# EasyEDA Pro project banzang电容_2023-06-19.epro, schematic POWER

## Sheets
1 POWER: Create Date: 2024-03-19; Page Name: POWER; Project Name: 河鸽の电容; Schematic Name: POWER; Update Date: 2024-03-19; Company: 嘉立创EDA; Page Size: B; Version: V1.0
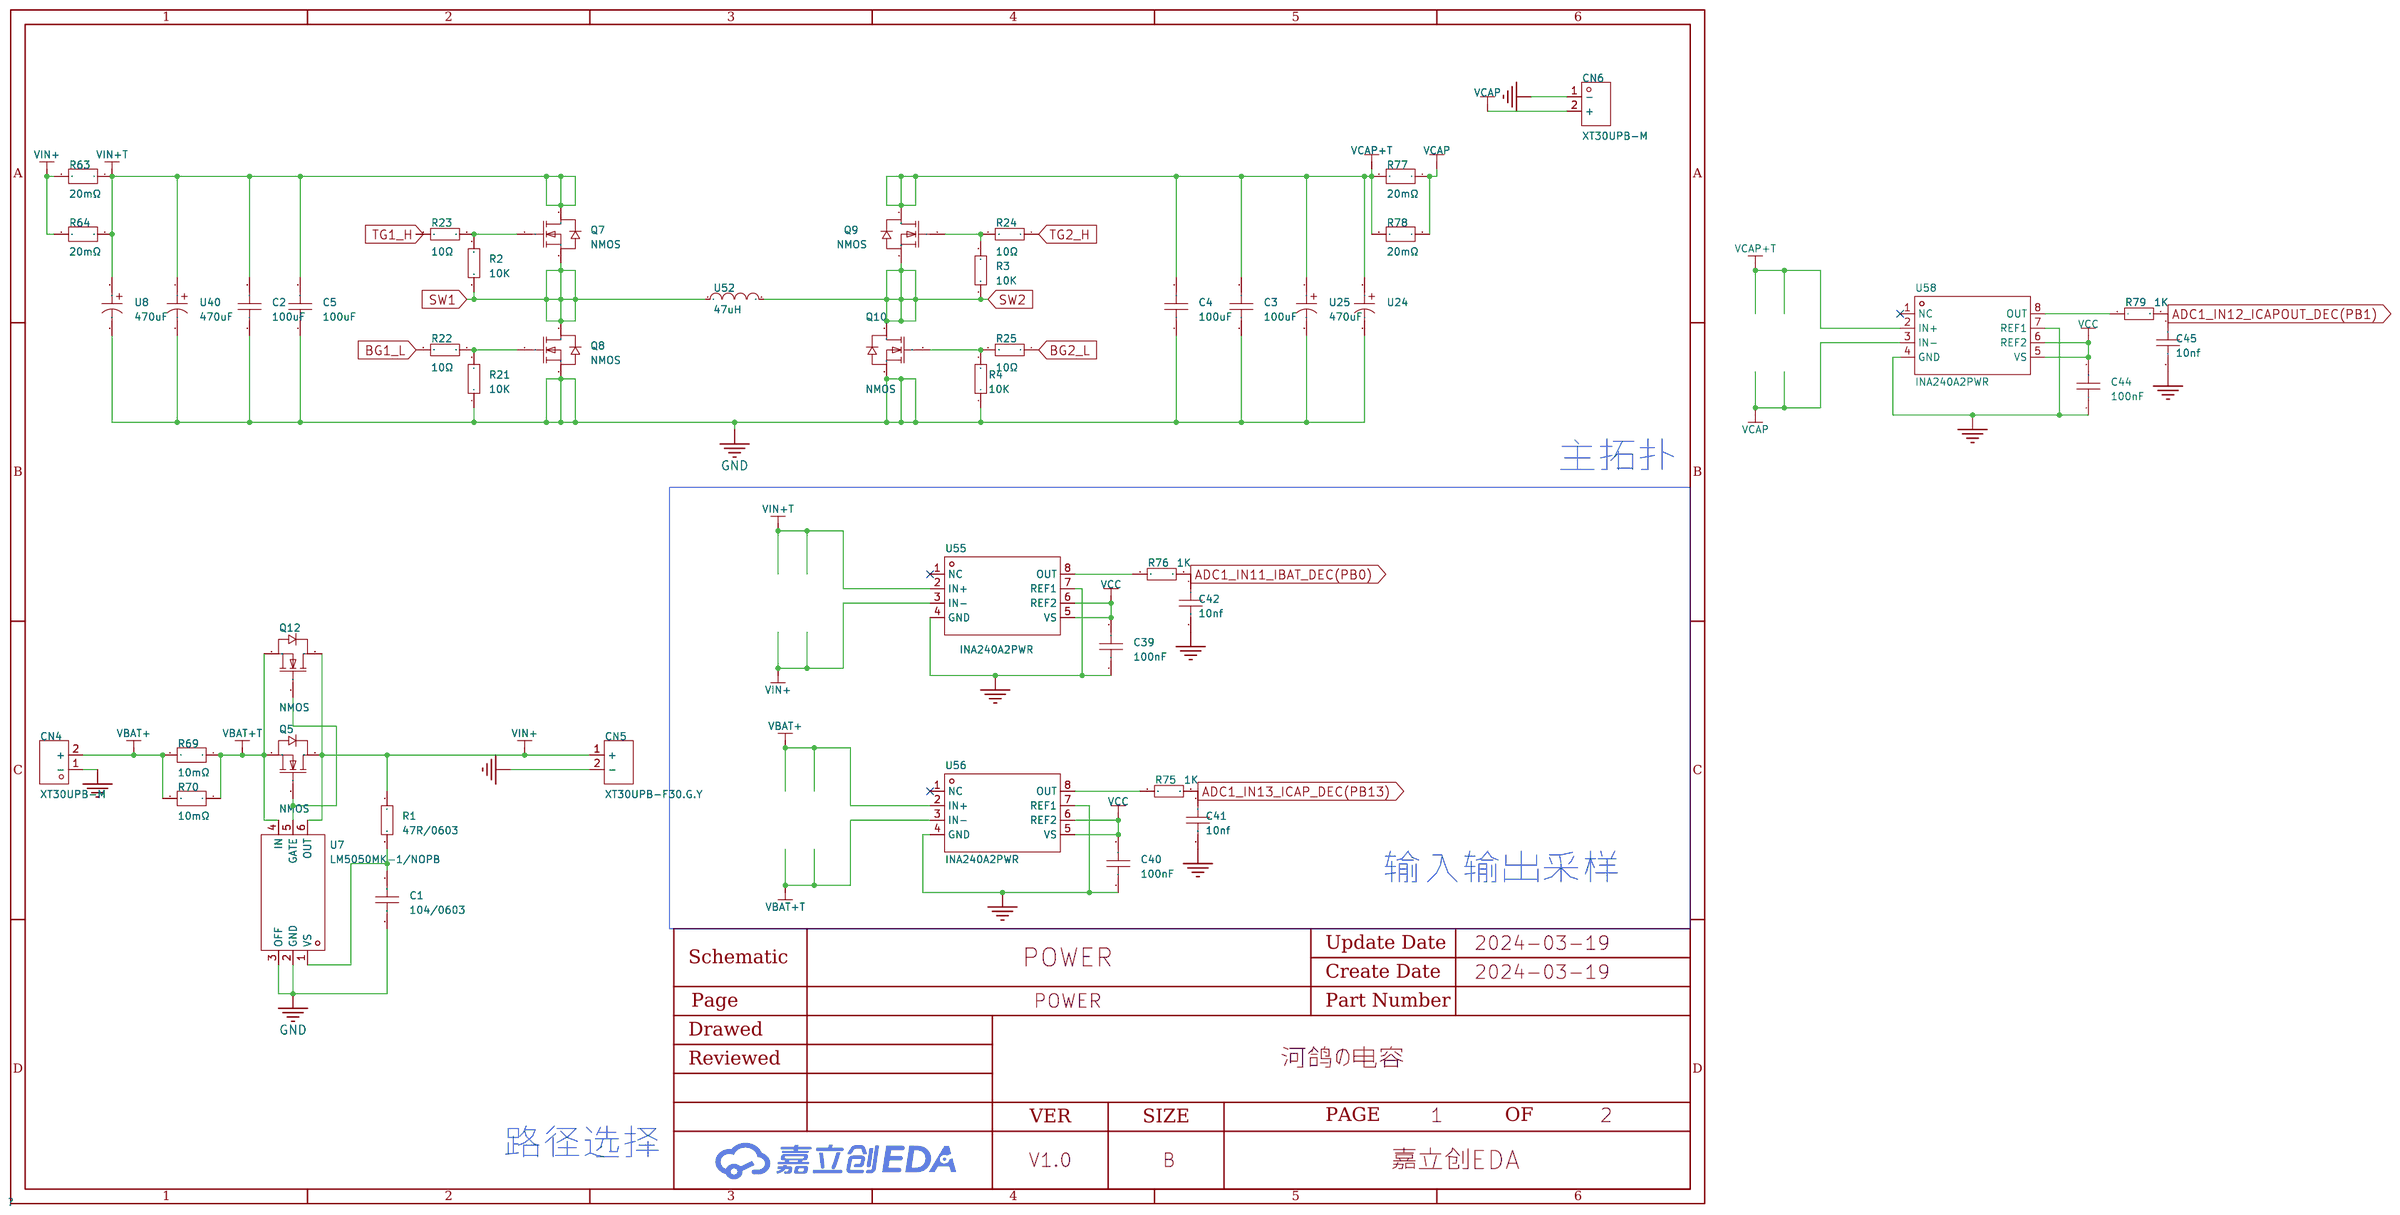
[diagram p0: POWER]
2 CONTROL: Create Date: 2023-07-25; Page Name: CONTROL; Update Date: 2023-10-28; Page Size: C
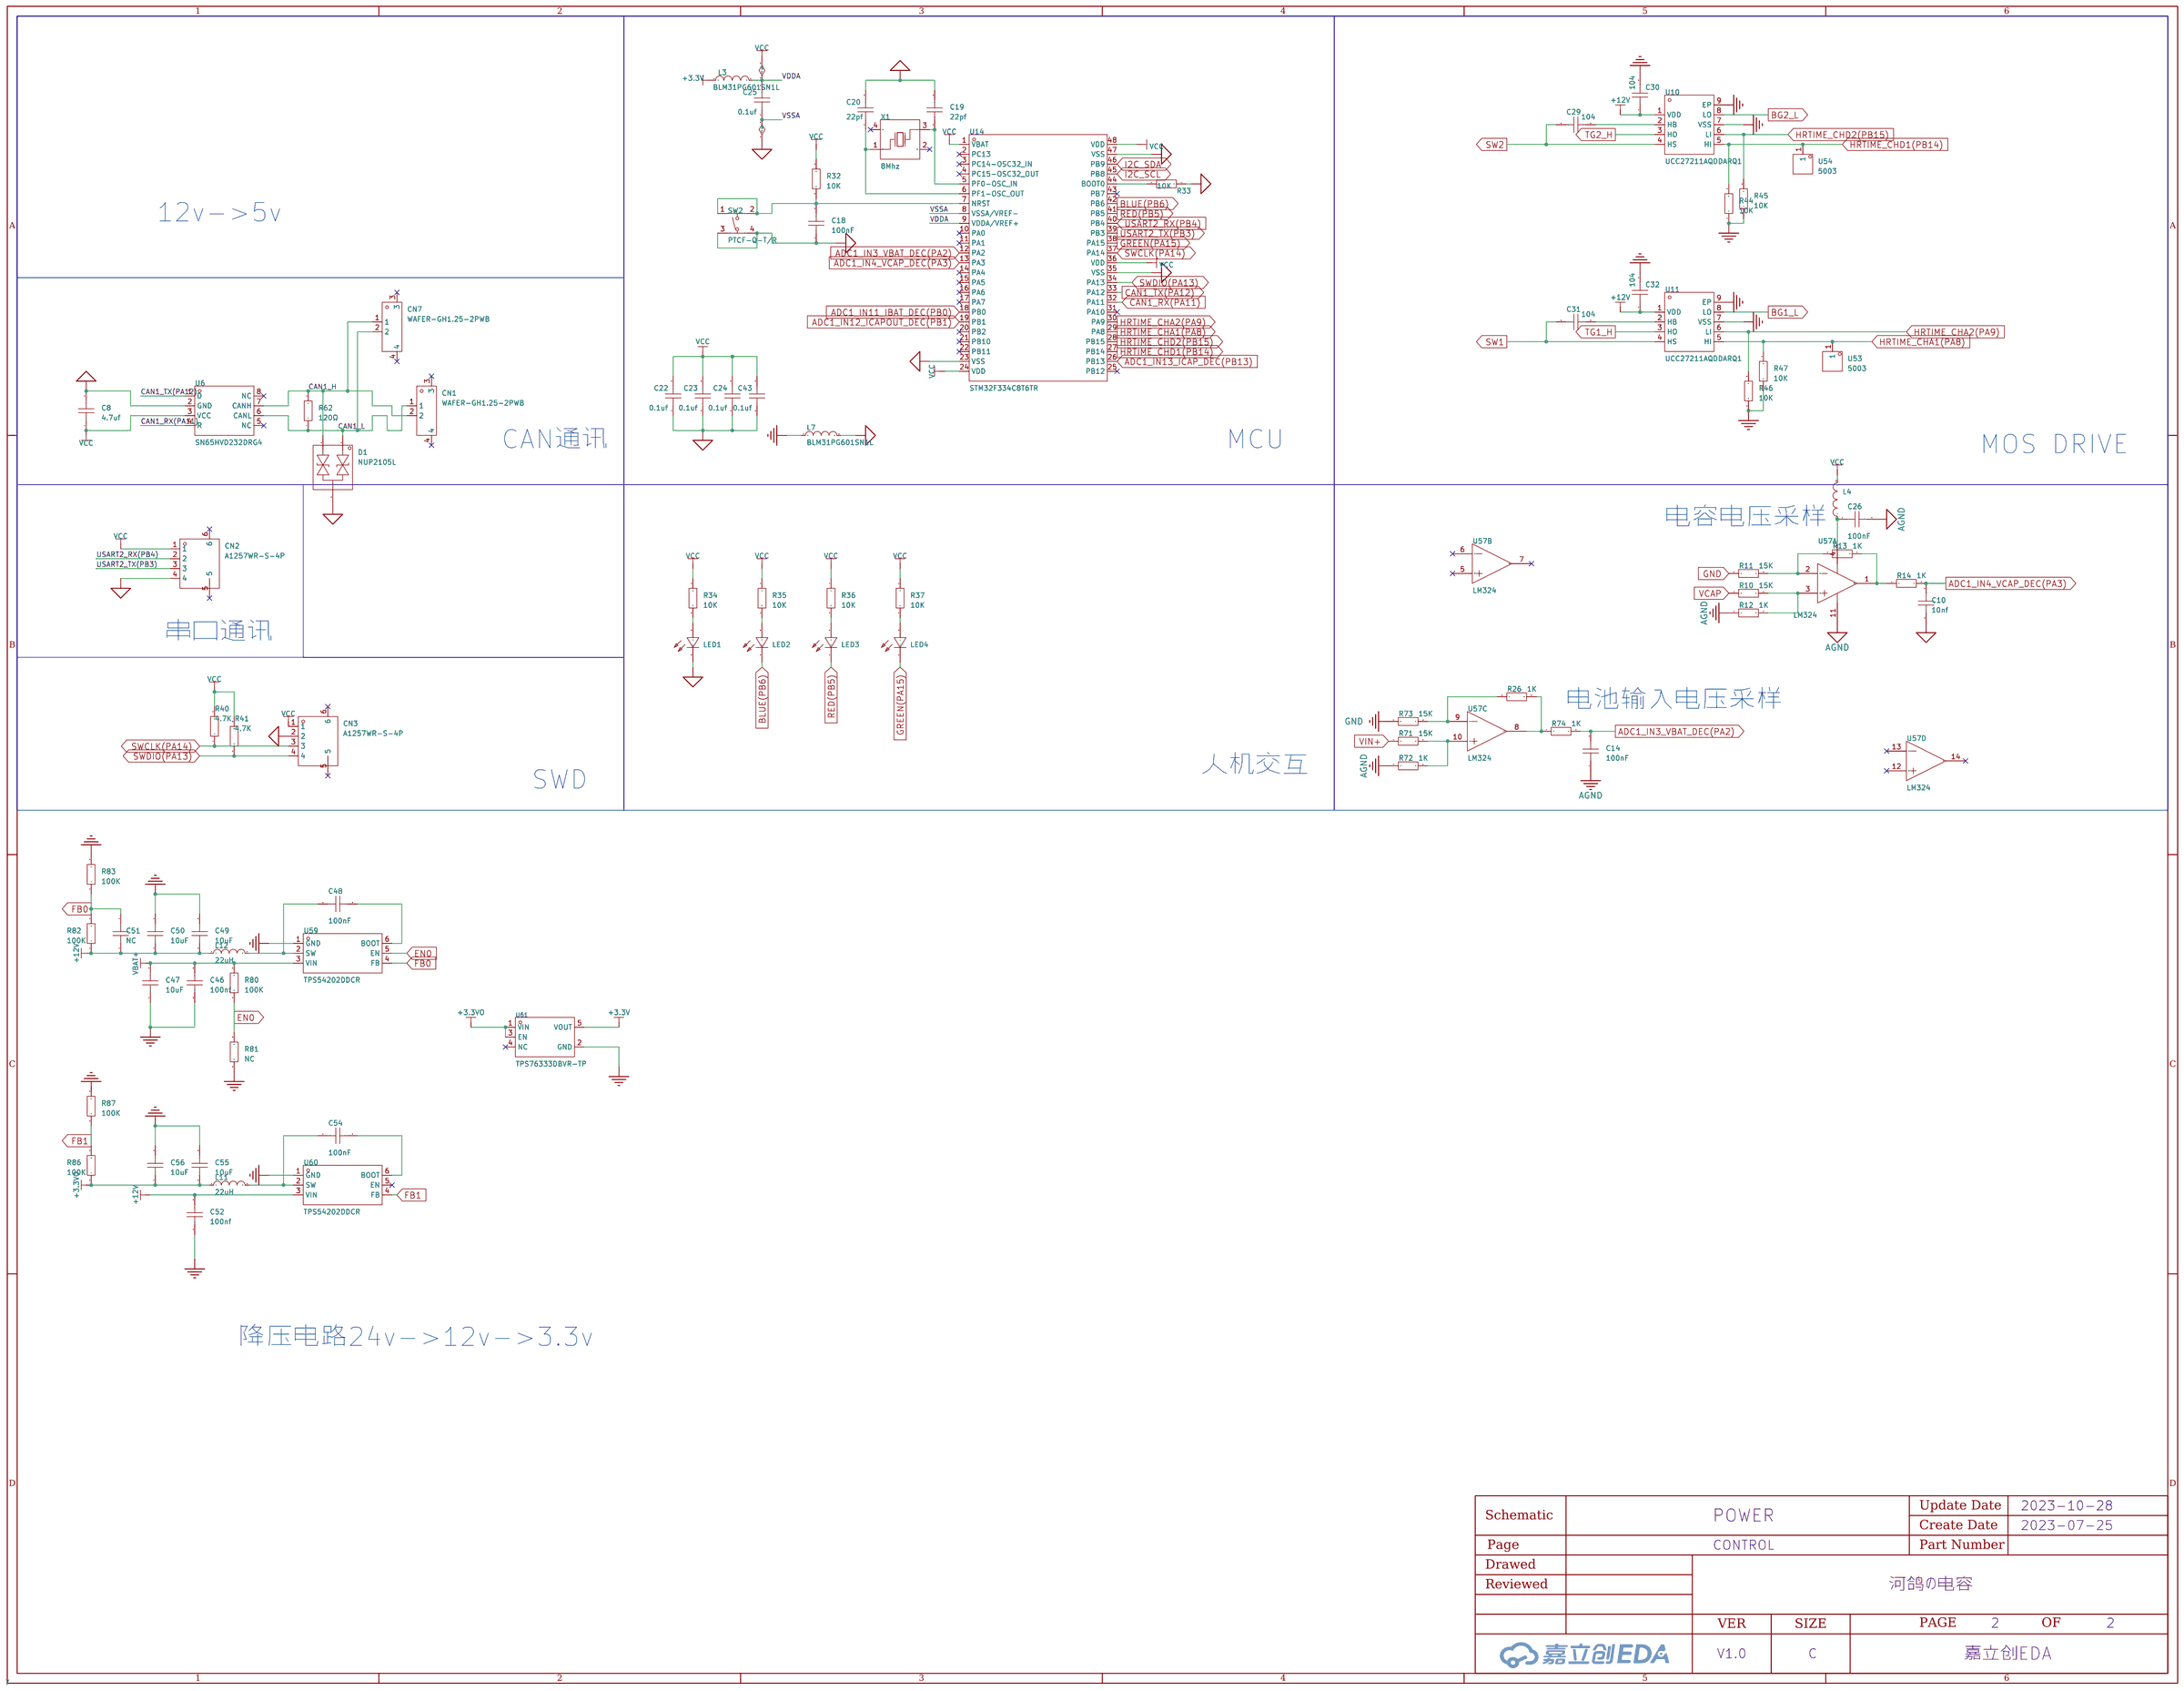
[diagram p1: CONTROL]

## Parts
sheet CONTROL
C8  4.7uf  [C0603]
C10  10nf  [C0603]
C14  100nF  [C0603]
C18  100nF  [C0603]
C19  22pf  [C0603]
C20  22pf  [C0603]
C22  0.1uf  [C0603]
C23  0.1uf  [C0603]
C24  0.1uf  [C0603]
C25  0.1uf  [C0603]
C26  100nF  [C0603]
C29  104  [C0603]
C30  104  [C0603]
C31  104  [C0603]
C32  104  [C0603]
C43  0.1uf  [C0603]
C46  100nf  [C0603]
C47  10uF  [C1206]
C48  100nF  [C0603]
C49  10uF  [C1206]
C50  10uF  [C1206]
C51  NC  [C0603]
C52  100nf  [C0603]
C54  100nF  [C0603]
C55  10uF  [C1206]
C56  10uF  [C1206]
CN1  WAFER-GH1.25-2PWB  [CONN-TH_2P-P1.25_XUNPU_WAFER-GH1.25-2PWB]
CN2  A1257WR-S-4P  [CONN-SMD_A1257WR-S-4P]
CN3  A1257WR-S-4P  [CONN-SMD_A1257WR-S-4P]
CN7  WAFER-GH1.25-2PWB  [CONN-TH_2P-P1.25_XUNPU_WAFER-GH1.25-2PWB]
D1  NUP2105L  [SOT-23-3_L2.9-W1.3-P1.90-LS2.4-BR]
L3  BLM31PG601SN1L  [L1206]
L4  10uH  [L1206]
L7  BLM31PG601SN1L  [L1206]
L11  22uH  [IND-SMD_L4.5-W4.0_CD43]
L12  22uH  [IND-SMD_L4.5-W4.0_CD43]
LED1  19-217/GHC-YR1S2/3T  [LED0603-RD]
LED2  19-217/GHC-YR1S2/3T  [LED0603-RD]
LED3  19-217/GHC-YR1S2/3T  [LED0603-RD]
LED4  19-217/GHC-YR1S2/3T  [LED0603-RD]
R10  15K  [R0603]
R11  15K  [R0603]
R12  1K  [R0603]
R13  1K  [R0603]
R14  1K  [R0603]
R26  1K  [R0603]
R32  10K  [R0603]
R33  10K  [R0603]
R34  10K  [R0603]
R35  10K  [R0603]
R36  10K  [R0603]
R37  10K  [R0603]
R40  4.7K  [R0603]
R41  4.7K  [R0603]
R44  10K  [R0603]
R45  10K  [R0603]
R46  10K  [R0603]
R47  10K  [R0603]
R62  120Ω  [R0603]
R71  15K  [R0603]
R72  1K  [R0603]
R73  15K  [R0603]
R74  1K  [R0603]
R80  100K  [R0603]
R81  NC  [R0603]
R82  100K  [R0603]
R83  100K  [R0603]
R86  100K  [R0603]
R87  100K  [R0603]
SW2  PTCF-Q-T/R  [SW-SMD_4P-L4.7-W3.5-P1.70-LS5.9]
U6  SN65HVD232DRG4  [SOIC-8_L4.9-W3.9-P1.27-LS6.0-BL]
U10  UCC27211AQDDARQ1  [SOPOWERPAD-8_L4.9-W3.9-P1.27-LS6.0-BL-EP]
U11  UCC27211AQDDARQ1  [SOPOWERPAD-8_L4.9-W3.9-P1.27-LS6.0-BL-EP]
U14  STM32F334C8T6TR  [LQFP-48_L7.0-W7.0-P0.50-LS9.0-BL]
U53  5003  [TEST-TH_BD2.54-P1.39]
U54  5003  [TEST-TH_BD2.54-P1.39]
U57  LM324  [SOP-14_L8.6-W3.9-P1.27-LS6.0-BL]  (sections 1,2,3,4)
U59  TPS54202DDCR  [SOT-23-6_L2.9-W1.6-P0.95-LS2.8-BL]
U60  TPS54202DDCR  [SOT-23-6_L2.9-W1.6-P0.95-LS2.8-BL]
U61  TPS76333DBVR-TP  [SOT-23-5_L3.0-W1.6-P0.95-LS2.8-BR]
X1  8Mhz  [OSC-SMD_4P-L3.2-W2.5-BL]
sheet POWER
C1  104/0603  [C0603]
C2  100uF  [C1210]
C3  100uF  [C1210]
C4  100uF  [C1210]
C5  100uF  [C1210]
C39  100nF  [C0603]
C40  100nF  [C0603]
C41  10nf  [C0603]
C42  10nf  [C0603]
C44  100nF  [C0603]
C45  10nf  [C0603]
CN4  XT30UPB-M  [CONN-TH_XT30UPB-M]
CN5  XT30UPB-F30.G.Y  [CONN-TH_XT30UPB-F]
CN6  XT30UPB-M  [CONN-TH_XT30UPB-M]
Q5  NMOS  [nmos qfn封装]
Q7  NMOS  [nmos qfn封装]
Q8  NMOS  [nmos qfn封装]
Q9  NMOS  [nmos qfn封装]
Q10  NMOS  [nmos qfn封装]
Q12  NMOS  [nmos qfn封装]
R1  47R/0603  [R0603]
R2  10K  [R0603]
R3  10K  [R0603]
R4  10K  [R0603]
R21  10K  [R0603]
R22  10Ω  [R0603]
R23  10Ω  [R0603]
R24  10Ω  [R0603]
R25  10Ω  [R0603]
R63  20mΩ  [RES-SMD_L6.4-W3.2-R2512]
R64  20mΩ  [RES-SMD_L6.4-W3.2-R2512]
R69  10mΩ  [RES-SMD_L6.4-W3.2-R2512]
R70  10mΩ  [RES-SMD_L6.4-W3.2-R2512]
R75  1K  [R0603]
R76  1K  [R0603]
R77  20mΩ  [RES-SMD_L6.4-W3.2-R2512]
R78  20mΩ  [RES-SMD_L6.4-W3.2-R2512]
R79  1K  [R0603]
U7  LM5050MK-1/NOPB  [TSOT-23-6_L2.9-W1.6-P0.95-LS2.8-BR]
U8  470uF  [CAP-TH_BD10.0-P5.00-D1.0-FD]
U24  470uF  [CAP-TH_BD10.0-P5.00-D1.0-FD]
U25  470uF  [CAP-TH_BD10.0-P5.00-D1.0-FD]
U40  470uF  [CAP-TH_BD10.0-P5.00-D1.0-FD]
U52  47uH  [IND-SMD_L17.2-W17.2]
U55  INA240A2PWR  [TSSOP-8_L4.4-W3.0-P0.65-LS6.4-BL]
U56  INA240A2PWR  [TSSOP-8_L4.4-W3.0-P0.65-LS6.4-BL]
U58  INA240A2PWR  [TSSOP-8_L4.4-W3.0-P0.65-LS6.4-BL]

## Library data of the parts
C1 C8 C10 C14 C18-C20 C22-C26 C29-C32 C39-C46 C48 C51 C52 C54 = CAP_0603: Supplier Footprint: 0603
C47 C49 C50 C55 C56 = CL31A106KBHNNNE: 容值:10uF;精度:±10%;额定电压:50V;材质(温度系数):X5R;; LCSC Part Name: 10uF ±10% 50V; Supplier Part: C13585; Manufacturer: SAMSUNG(三星); Supplier Footprint: 1206; JLCPCB Part Class: Basic Part; Datasheet: https://atta.szlcsc.com/upload/public/pdf/source/20160103/1457707668742.pdf; Supplier: LCSC; Tolerance: ±10%; Voltage Rated: 50V; Temperature Coefficient: X5R
CN1 CN7 = WAFER-GH1.25-2PWB: 参考系列:GH;间距:1.25mm;插针结构:1x2P;排数:1;每排PIN数:2;公母:公型插针;安装方式:卧贴;额定电流:1A;工作温度范围:-25℃~+85℃;; LCSC Part Name: GH1.25mm 2P 卧贴带扣 带扣; Supplier Part: C3029377; Manufacturer: XUNPU(讯普); Supplier Footprint: SMD,P=1.25mm; JLCPCB Part Class: Extended Part; Datasheet: https://atta.szlcsc.com/upload/public/pdf/source/20220527/CB8773BFB0913C3B8ABD62CB38BA101A.pdf; Supplier: LCSC; Reference Series: GH; Pitch: 1.25mm; Pins Structure: 1x2P; Number of Rows: 1; Number of PINs Per Row: 2; Gender: 公型插针; Mounting Style: 卧贴; Current Rating (Max): 1A; Operating Temperature Range: -25℃~+85℃
CN2 CN3 = A1257WR-S-4P: 参考系列:GH;间距:1.25mm;插针结构:1x4P;排数:1;每排PIN数:4;行距:-;安装方式:-;触头材质:黄铜;; LCSC Part Name: GH1.25卧式贴片 镀锡 4P 针座连接器; Supplier Part: C225127; Manufacturer: CJT(长江连接器); Supplier Footprint: SMD,P=1.25mm; JLCPCB Part Class: Extended Part; Datasheet: https://atta.szlcsc.com/upload/public/pdf/source/20180509/C225127_D8D3C7F8F1F45F960D198B1E232900BE.pdf; Supplier: LCSC; Reference Series: GH; Pitch: 1.25mm; Pins Structure: 1x4P; Number of Rows: 1; Number of PINs Per Row: 4; Contact Material: 黄铜
D1 = NUP2105L: 双向 反向截止电压(Vrwm)：24V@Max 击穿电压(最小值)：26.7V 峰值脉冲电流(Ipp)@10/1000μs：8A@8/20us 最大钳位电压：54V; Supplier Part: C284104; Manufacturer: DOWO(东沃); Supplier Footprint: SOT-23; JLCPCB Part Class: Extended Part; Datasheet: https://atta.szlcsc.com/upload/public/pdf/source/20180913/C284104_A285154D8E570FC0FA2D74308019D511.pdf; Supplier: LCSC
L3 L7 = BLM31PG601SN1L: 标称阻抗@测试频率:600Ω@100MHz;误差:±25%;直流电阻(RDC):80mΩ;额定电流:1.5A;电路数:1;; LCSC Part Name: 600Ω@100MHz ±25%; Supplier Part: C16902; Manufacturer: muRata(村田); Supplier Footprint: 1206; JLCPCB Part Class: Extended Part; Datasheet: https://atta.szlcsc.com/upload/public/pdf/source/20170523/1495534024788.pdf; Supplier: LCSC; Impedance @ Frequency: 600Ω@100MHz; Tolerance: ±25%; DC Resistance: 80mΩ; Current Rating: 1.5A; Circuits: 1
L4 = 1206磁珠500R20%2A: Supplier Part: C9900009879; JLCPCB Part Class: Extended Part; Datasheet: https://atta.szlcsc.comnull; Supplier: LCSC
L11 L12 = CD43-220M: 额定电流:760mA;电感值:22uH;精度:±20%;直流电阻(DCR):378mΩ;; LCSC Part Name: 22uH ±20%; Supplier Part: C2826645; Manufacturer: DMBJ(振宝佳); Supplier Footprint: SMD; JLCPCB Part Class: Extended Part; Datasheet: https://atta.szlcsc.com/upload/public/pdf/source/20210416/C2826610_BD9EF4281FEC8102FBF66339CC69A197.pdf; Supplier: LCSC; Rated Current: 760mA; Tolerance: ±20%; Length: 4.5mm; DC Resistance (DCR): 378mΩ; Width: 4mm; Height: 3.2mm
LED1-LED4 = 19-217/GHC-YR1S2/3T: 发光颜色:翠绿;二极管配置:-;透镜颜色:无色透明;主波长:520nm~535nm;峰值波长:518nm;色温:-;测试电流:20mA;功率:110mW;发光角度:120°;安装方式:-;工作温度:-40℃~+85℃;; LCSC Part Name: 翠绿 520nm~535nm; Supplier Part: C72043; Manufacturer: EVERLIGHT(亿光); Supplier Footprint: 0603; JLCPCB Part Class: Basic Part; Datasheet: https://atta.szlcsc.com/upload/public/pdf/source/20160507/1462613613780.pdf; Supplier: LCSC; Emitted Color: 翠绿; Lens Color: 无色透明; Dominant Wavelength: 520nm~535nm; Peak Wavelength: 518nm; Forward Current: 20mA; Power Dissipation: 110mW; Viewing Angle: 120°; Operating Temperature: -40℃~+85℃
R1-R4 R10-R14 R21-R26 R32-R37 R40 R41 R44-R47 R62 R71-R76 R79-R83 R86 R87 = Res_0603: Supplier Footprint: 0603
SW2 = PTCF-Q-T/R: 触点电流:50mA;额定电压(DC):12V;电路结构:单刀单掷;按钮作用方向:侧面触动;致动器样式:矩形按钮;照明颜色:-;; LCSC Part Name: 侧按贴片; Supplier Part: C495928; Manufacturer: 圜达; Supplier Footprint: SMD,3.5x4.7mm; JLCPCB Part Class: Extended Part; Datasheet: https://atta.szlcsc.com/upload/public/pdf/source/20180719/C240298_0F3C3519E61C16272A76D63807525503.pdf; Supplier: LCSC; Contact Current: 50mA; Voltage Rating (DC): 12V; Circuit: 单刀单掷; Actuator Orientation: 侧面触动; Actuator Style: 矩形按钮
U6 = SN65HVD232DRG4: Supplier Part: C2671240; Manufacturer: TI(德州仪器); Supplier Footprint: SOIC-8; JLCPCB Part Class: Extended Part; Datasheet: https://atta.szlcsc.com/upload/public/pdf/source/20230221/761194AB8107AFD8187F7EF0A2DBB768.pdf; Supplier: LCSC
U10 U11 = UCC27211AQDDARQ1: 驱动配置:半桥;负载类型:MOSFET;电源电压:8V~17V;峰值灌电流:4A;峰值拉电流:4A;; LCSC Part Name: 半桥 MOSFET 灌:4A 拉:4A; Supplier Part: C485921; Manufacturer: TI(德州仪器); Supplier Footprint: SO-8; JLCPCB Part Class: Extended Part; Datasheet: https://atta.szlcsc.com/upload/public/pdf/source/20200118/C485921_1F67256384C13A8015BF90ADB18440B8.pdf; Supplier: LCSC; Driven Configuration: 半桥; Number of Drivers: 2; loadtype: MOSFET; Supply Voltage: 8V~17V; Peak Output Current(sink): 4A; Peak Output Current(source): 4A; Rise Time: 7.2ns; Fall Time: 5.5ns; Operating Temperature: -40℃~+140℃@(Tj)
U14 = STM32F334C8T6TR: Supplier Part: C1857448; Manufacturer: ST(意法半导体); Supplier Footprint: LQFP-48(7x7); JLCPCB Part Class: Extended Part; Datasheet: https://atta.szlcsc.com/upload/public/pdf/source/20200511/C529325_289533FF64F16BC0634D133312BFDAD2.pdf; Supplier: LCSC
U53 U54 = 5003: 类型:测试环;全长/全高:7.62mm;工作高度:-;接触电阻:-;弹性寿命:-;额定电流:-;额定电压:-;触头材质:磷青铜;触头镀层:-;工作温度范围:-;; Supplier Part: C238124; Manufacturer: Keystone; JLCPCB Part Class: Extended Part; Datasheet: https://atta.szlcsc.com/upload/public/pdf/source/20180629/C238124_11BD2E2A2950E8BDAC768C438ECF8773.PDF; Supplier: LCSC; Type: 测试环; Overall Length/Height: 7.62mm; Contact Material: 磷青铜
U57 = LM324: Supplier Part: C2829425; Manufacturer: CJ(江苏长电/长晶); Supplier Footprint: SOP-14; JLCPCB Part Class: Extended Part; Datasheet: https://atta.szlcsc.com/upload/public/pdf/source/20220509/46BB13E56094222C690EE06C16535107.pdf; Supplier: LCSC
U59 U60 = TPS54202DDCR: 可输出电流:2A;开关工作频率:500kHz;输出类型:Adjustable;输出电压的路数:1;功能类型:Step-Down;输出配置:Positive;; Supplier Part: C191884; Manufacturer: TI(德州仪器); Supplier Footprint: SOT-23-6; JLCPCB Part Class: Extended Part; Datasheet: https://atta.szlcsc.com/upload/public/pdf/source/20181012/C191884_C6DBFD980275651BD8C8F427C2E48058.pdf; Supplier: LCSC
U61 = TPS76333DBVR-TP: LCSC Part Name: TPS76333DBVR; Supplier Part: C5380675; Manufacturer: TECH PUBLIC(台舟); Supplier Footprint: SOT-23-5; Datasheet: https://atta.szlcsc.com/upload/public/pdf/source/20230627/5BEFC9B7398D26533134A984DCF851A4.pdf; Supplier: LCSC
X1 = X322516MLB4SI: 频率:16MHz;频率公差:±10ppm;频率稳定度:±30ppm;负载电容:9pF;; LCSC Part Name: 16MHz ±10ppm 9pF; Supplier Part: C13738; Manufacturer: YXC(扬兴晶振); Supplier Footprint: SMD3225-4P; JLCPCB Part Class: Basic Part; Datasheet: https://atta.szlcsc.com/upload/public/pdf/source/20210329/C112971_1F611BDC486E193C1706F6D8EB5AA189.pdf; Supplier: LCSC; Crystal Type: 贴片无源晶振; Frequency Tolerance: ±10ppm; Frequency Stability: ±30ppm; Load Capacitance: 9pF; Operating Temperature: -40℃~+85℃
C2-C5 = EMK325ABJ107MM-P: 容值:100uF;精度:±20%;额定电压:16V;材质(温度系数):X5R;; LCSC Part Name: 100uF ±20% 16V; Supplier Part: C90143; Manufacturer: TAIYO YUDEN(太诱); Supplier Footprint: 1210; JLCPCB Part Class: Extended Part; Datasheet: https://atta.szlcsc.com/upload/public/pdf/source/20190902/C90143_6CB75A095DFF9740D13406046689E055.pdf; Supplier: LCSC; Tolerance: ±20%; Voltage Rated: 16V; Temperature Coefficient: X5R
CN4 CN6 = XT30UPB-M: LCSC Part Name: AMASS(艾迈斯)板载立式 航模锂电池控制器连接器插头 公头XT30UPB-M; Supplier Part: C428721; Manufacturer: AMASS(艾迈斯); JLCPCB Part Class: Extended Part; Datasheet: https://atta.szlcsc.com/upload/public/pdf/source/20230412/7B5DFEF57C9EA5273853390C734B3AC5.pdf; Supplier: LCSC
CN5 = XT30UPB-F30.G.Y: 模型插头连接器; LCSC Part Name: AMASS(艾迈斯)直立焊板式连接器XT30UPB30-F.G.*; Supplier Part: C108769; Manufacturer: AMASS(艾迈斯); JLCPCB Part Class: Extended Part; Datasheet: https://atta.szlcsc.com/upload/public/pdf/source/20220715/AFD68B9E8B6CA95A7295DBF4AF9325E4.pdf; Supplier: LCSC
Q5 Q7-Q10 Q12 = NMOS
R63 R64 R77 R78 = HoJLR2512-3W-50mR-1%: 阻值:50mΩ;功率:3W;; LCSC Part Name: 50mΩ 3W; Supplier Part: C2903475; Manufacturer: Milliohm(毫欧); Supplier Footprint: 2512; JLCPCB Part Class: Extended Part; Datasheet: https://atta.szlcsc.com/upload/public/pdf/source/20211009/7525CABAB363C979E942C1DD41F1FEF0.pdf; Supplier: LCSC; Power(Watts): 3W
R69 R70 = HoJLR2512-3W-10mR-1%: 阻值:10mΩ;功率:3W;; LCSC Part Name: 10mΩ 3W; Supplier Part: C2903468; Manufacturer: Milliohm(毫欧); Supplier Footprint: 2512; JLCPCB Part Class: Extended Part; Datasheet: https://atta.szlcsc.com/upload/public/pdf/source/20211009/7525CABAB363C979E942C1DD41F1FEF0.pdf; Supplier: LCSC; Power(Watts): 3W
U7 = LM5050MK-1/NOPB: LM5050-1 高侧 ORing FET 控制器; Supplier Part: C129323; Manufacturer: TI(德州仪器); Supplier Footprint: TSOT-23-6; JLCPCB Part Class: Extended Part; Datasheet: https://atta.szlcsc.com/upload/public/pdf/source/20170914/C129323_1505359957620968163.pdf; Supplier: LCSC
U8 U24 U25 U40 = 50PX470MEFC10X20: 容值:470uF;精度:±20%;额定电压:50V;; LCSC Part Name: 470uF ±20% 50V; Supplier Part: C88733; Manufacturer: rubycon(红宝石); Supplier Footprint: 插件,D10xL20mm; JLCPCB Part Class: Extended Part; Datasheet: https://atta.szlcsc.com/upload/public/pdf/source/20161125/1480067873684.pdf; Supplier: LCSC; Tolerance: ±20%; Rated Voltage: 50V; φD: 10mm; L: 20mm; Lead Spacing: 5mm; Lifetime @ Temp: 2000hrs@105℃; Ripple Current: 2.6A@100kHz; Equivalent Series Resistance(ESR): 18mΩ@100kHz
U52 = APH1770T470M: 类型:一体成型电感;电感值:47uH;精度:±20%;额定电流:5.1A;饱和电流(Isat):6.3A;; LCSC Part Name: 47uH ±20% 6.3A; Supplier Part: C5349653; Manufacturer: APV(爱普微); Supplier Footprint: L1770; JLCPCB Part Class: Extended Part; Datasheet: https://atta.szlcsc.com/upload/public/pdf/source/20230112/3804689C683B35ADD5E9934FF2FC4946.pdf; Supplier: LCSC; Type: 一体成型电感; Tolerance: ±20%; Rated Current: 5.1A; Saturation Current (Isat): 6.3A; DC Resistance (DCR): 47mΩ
U55 U56 U58 = INA240A2PWR: INA240 电压输出、高/低侧测量、双向零漂移系列; Supplier Part: C129949; Manufacturer: TI(德州仪器); Supplier Footprint: TSSOP-8; JLCPCB Part Class: Extended Part; Datasheet: https://atta.szlcsc.com/upload/public/pdf/source/20170918/C129949_1505700148139974986.pdf; Supplier: LCSC

## Nets
+3.3V: L3.1 U61.5(VOUT)
+3.3VO: C55.1 C56.1 L11.1 R86.1 U61.1(VIN) U61.3(EN)
+12V: C30.1 C32.1 C49.1 C50.1 C51.1 C52.2 L12.1 R82.1 U10.1(VDD) U11.1(VDD) U60.3(VIN)
AGND: C8.2 C10.2 C14.1 C18.1 C19.2 C20.2 C22.1 C23.1 C24.1 C25.1 C26.2 C43.1 CN2.4 CN3.2 D1.3 L7.2 LED1.1(C) R12.1 R33.1 R72.1 SW2.3 SW2.4 U6.2(GND) U14.8(VSSA/VREF-) U14.23(VSS) U14.35(VSS) U14.47(VSS) U57.11(VSS)
GND: C1.2 C2.1 C3.1 C4.1 C5.1 C30.2 C32.2 C39.1 C40.1 C41.2 C42.2 C44.1 C45.2 C46.1 C47.1 C49.2 C50.2 C52.1 C55.2 C56.2 CN4.1(-) CN5.2(-) CN6.1(-) L7.1 Q8.3(S) Q10.3(S) R4.1 R11.1 R21.1 R44.1 R45.1 R46.1 R47.1 R73.1 R81.1 R83.2 R87.2 U7.2(GND) U7.3(OFF) U8.2 U10.7(VSS) U10.9(EP) U11.7(VSS) U11.9(EP) U24.2 U25.2 U40.2 U55.4(GND) U55.7(REF1) U56.4(GND) U56.7(REF1) U58.4(GND) U58.7(REF1) U59.1(GND) U60.1(GND) U61.2(GND)
VBAT+: C46.2 C47.2 CN4.2(+) R69.2 R70.2 R80.2 U56.2(IN+) U59.3(VIN)
VBAT+T: Q5.3(S) Q12.3(S) R69.1 R70.1 U7.4(IN) U56.3(IN-)
VCC: C8.1 C22.2 C23.2 C24.2 C25.2 C39.2 C40.2 C43.2 C44.2 CN2.1 CN3.1 L3.2 L4.2 R32.2 R34.1 R35.1 R36.1 R37.1 R40.2 R41.2 U6.3(VCC) U14.1(VBAT) U14.9(VDDA/VREF+) U14.24(VDD) U14.36(VDD) U14.48(VDD) U55.5(VS) U55.6(REF2) U56.5(VS) U56.6(REF2) U58.5(VS) U58.6(REF2)
VIN+: CN5.1(+) Q5.2(D) Q12.2(D) R1.1 R63.2 R64.2 R71.1 U7.6(OUT) U55.3(IN-)
VIN+T: C2.2 C5.2 Q7.2(D) R63.1 R64.1 U8.1 U40.1 U55.2(IN+)
ADC1_IN3_VBAT_DEC(PA2): C14.2 R74.2 U14.12(PA2)
ADC1_IN4_VCAP_DEC(PA3): C10.1 R14.2 U14.13(PA3)
ADC1_IN11_IBAT_DEC(PB0): C42.1 R76.2 U14.18(PB0)
ADC1_IN12_ICAPOUT_DEC(PB1): C45.1 R79.2 U14.19(PB1)
ADC1_IN13_ICAP_DEC(PB13): C41.1 R75.2 U14.26(PB13)
BG1_L: R22.2 U11.8(LO)
BG2_L: R25.1 U10.8(LO)
BLUE(PB6): LED2.1(C) U14.42(PB6)
CAN1_H: CN1.2 CN7.1 D1.2 R62.2 U6.7(CANH)
CAN1_L: CN1.1 CN7.2 D1.1 R62.1 U6.6(CANL)
CAN1_RX(PA11): U6.4(R) U14.32(PA11)
CAN1_TX(PA12): U6.1(D) U14.33(PA12)
EN0: R80.1 R81.2 U59.5(EN)
FB0: C51.2 R82.2 R83.1 U59.4(FB)
FB1: R86.2 R87.1 U60.4(FB)
GREEN(PA15): LED4.1(C) U14.38(PA15)
HRTIME_CHA1(PA8): R47.2 U11.5(HI) U14.29(PA8) U53.1
HRTIME_CHA2(PA9): R46.2 U11.6(LI) U14.30(PA9)
HRTIME_CHD1(PB14): R44.2 U10.5(HI) U14.27(PB14) U54.1
HRTIME_CHD2(PB15): R45.2 U10.6(LI) U14.28(PB15)
I2C_SCL: U14.45(PB8)
I2C_SDA: U14.46(PB9)
RED(PB5): LED3.1(C) U14.41(PB5)
SW1: C31.1 Q7.3(S) Q8.2(D) R2.1 U11.4(HS) U52.1
SW2: C29.1 Q9.3(S) Q10.2(D) R3.1 U10.4(HS) U52.2
SWCLK(PA14): CN3.3 R40.1 U14.37(PA14)
SWDIO(PA13): CN3.4 R41.1 U14.34(PA13)
TG1_H: R23.2 U11.3(HO)
TG2_H: R24.1 U10.3(HO)
USART2_RX(PB4): CN2.2 U14.40(PB4)
USART2_TX(PB3): CN2.3 U14.39(PB3)
VCAP: CN6.2(+) R10.1 R77.1 R78.1 U58.3(IN-)
VCAP+T: C3.2 C4.2 Q9.2(D) R77.2 R78.2 U24.1 U25.1 U58.2(IN+)
$1N328: C1.1 R1.2 U7.1(VS)
$1N1423: Q10.1(G) R4.2 R25.2
$1N1424: Q9.1(G) R3.2 R24.2
$1N1425: Q7.1(G) R2.2 R23.1
$1N1426: Q8.1(G) R21.2 R22.1
$1N12542: R76.1 U55.8(OUT)
$1N12839: R75.1 U56.8(OUT)
$1N14388: Q5.1(G) Q12.1(G) U7.5(GATE)
$1N14671: R79.1 U58.8(OUT)
$2N2913: C29.2 U10.2(HB)
$2N2920: C31.2 U11.2(HB)
$2N2938: C20.1 U14.6(PF1-OSC_OUT) X1.1(OSC1)
$2N2946: R33.2 U14.44(BOOT0)
$2N2947: LED1.2(A) R34.2
$2N2950: LED2.2(A) R35.2
$2N2953: LED3.2(A) R36.2
$2N2956: LED4.2(A) R37.2
$2N3017: C19.1 U14.5(PF0-OSC_IN) X1.3(OSC2)
$2N3018: C18.2 R32.1 SW2.1 SW2.2 U14.7(NRST)
$2N8090: R10.2 R12.2 U57.3(VINA+)
$2N8093: R11.2 R13.1 U57.2(VINA-)
$2N8094: R13.2 R14.1 U57.1(VOUTA)
$2N12308: C26.1 L4.1 U57.4(VDD)
$2N12545: R71.2 R72.2 U57.10(VINC+)
$2N12555: R26.1 R73.2 U57.9(VINC-)
$2N12559: R26.2 R74.1 U57.8(VOUTC)
$2N20212: C48.1 L12.2 U59.2(SW)
$2N20262: C48.2 U59.6(BOOT)
$2N20919: C54.1 L11.2 U60.2(SW)
$2N20924: C54.2 U60.6(BOOT)

Not connected (* = marked no-connect by the designer): CN1 3* 4*; CN2 5* 6*; CN3 5* 6*; CN7 3* 4*; U6 5(NC)* 8(NC)*; U14 2(PC13)* 3(PC14-OSC32_IN)* 4(PC15-OSC32_OUT)* 10(PA0)* 11(PA1)* 14(PA4)* 15(PA5)* 16(PA6)* 17(PA7)* 20(PB2)* 21(PB10)* 22(PB11)* 25(PB12)* 31(PA10)* 43(PB7)*; U55 1(NC)*; U56 1(NC)*; U57 5(VINB+)* 6(VINB-)* 7(VOUTB)* 12(VIND+)* 13(VIND-)* 14(VOUTD)*; U58 1(NC)*; U60 5(EN)*; U61 4(NC)*; X1 2(GND)* 4(GND)*

## Notes on the sheets
sheet 1
- 主拓扑
- 输入输出采样
- 路径选择
sheet 2
- 12v->5v
- CAN通讯
- MCU
- MOS DRIVE
- 电容电压采样
- 串口通讯
- 电池输入电压采样
- 人机交互
- SWD
- 降压电路24v->12v->3.3v
